# EAGLE schematic RC_Low_Pass_Filter (EAGLE 7.5.0)
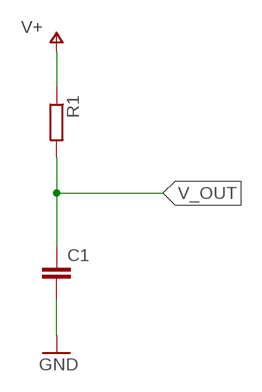
[diagram p0: schematic, sheet 1]

## Parts
C1  C-EU025-024X044  [C025-024X044]
R1  R-EU_R0805  [R0805]

## Nets
GND: C1.2
V+: R1.1
V_OUT: C1.1 R1.2

## Library data of the parts
C1 = rcl:C-EU: CAPACITOR, European symbol
R1 = rcl:R-EU_: RESISTOR, European symbol